# Altium project STM32P20.PrjPCB
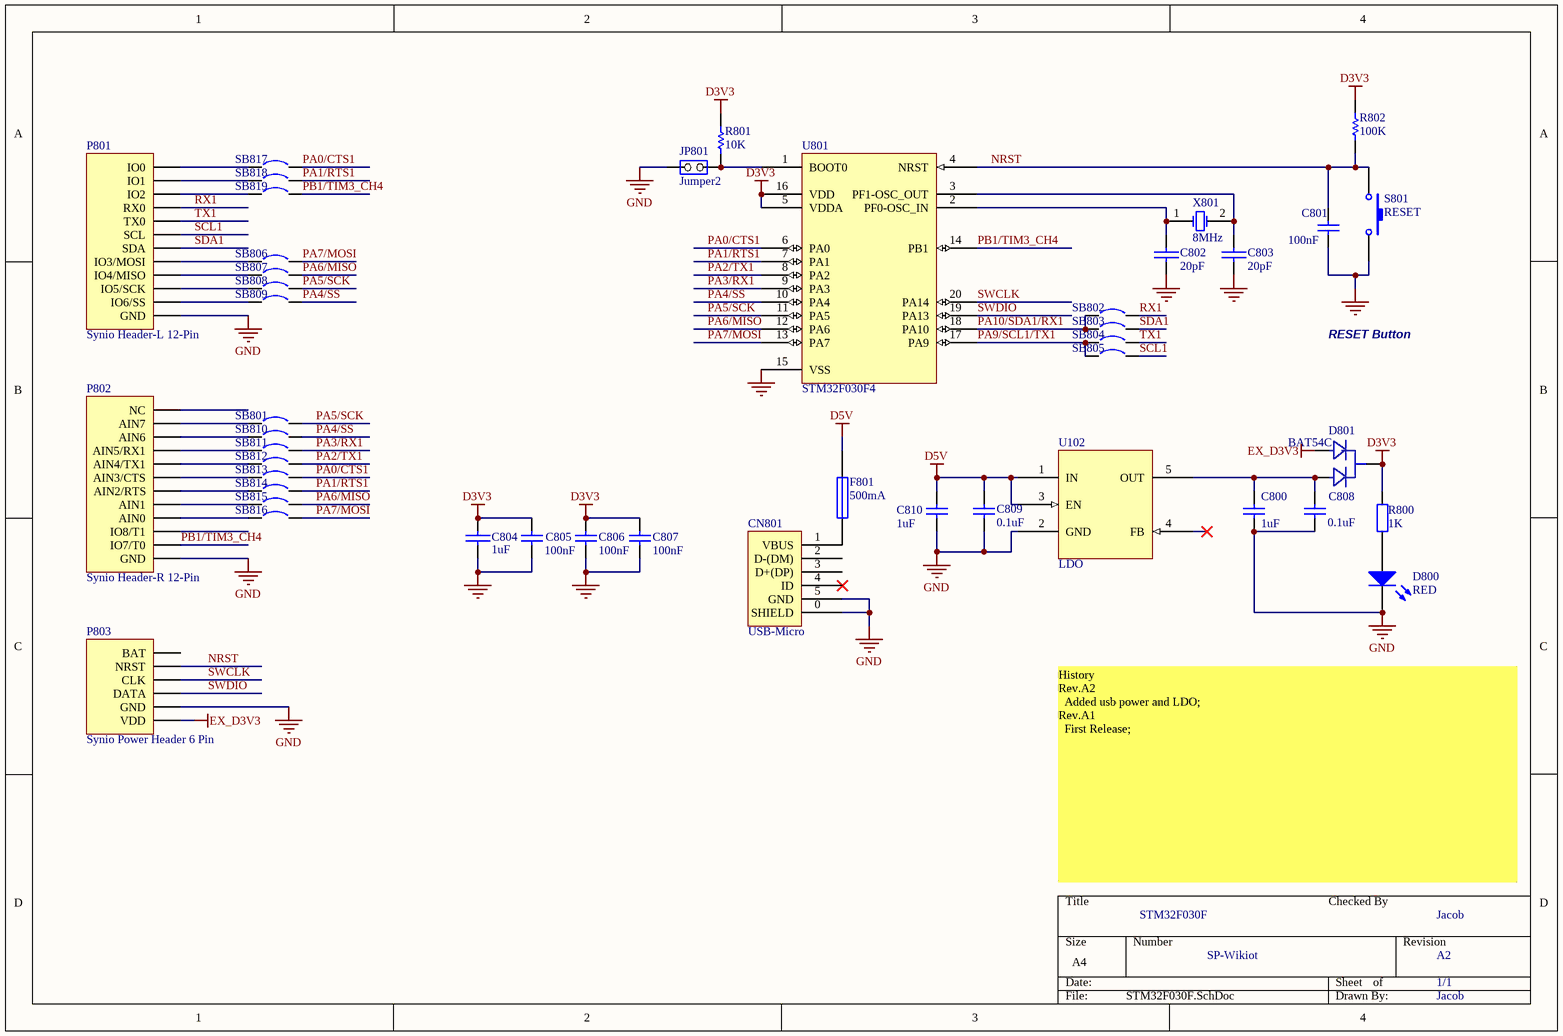
[diagram p0: STM32F030F.SchDoc]
1 sheet, 45 parts. Net scope: global (net labels, ports and power ports of the same name join across sheets).
Board file: STM32F030F.PcbDoc

## Sheet STM32F030F.SchDoc
size A4

### Parts
C800  1uF  [0603M]
C801  100nF  [0603M]
C802  20pF  [0603M]
C803  20pF  [0603M]
C804  1uF  [0603M]
C805  100nF  [0603M]
C806  100nF  [0603M]
C807  100nF  [0603M]
C808  0.1uF  [0603M]
C809  0.1uF  [0603M]
C810  1uF  [0603M]
CN801  USB-Micro  [USB-MICRO-Female-Lite]
D800  RED  [0603pn]
D801  BAT54C  [BAT54C]
F801  500mA  [0805]
JP801  Jumper2  [SIP2]
P801  Synio Header-L 12-Pin  [HDR1X12]
P802  Synio Header-R 12-Pin  [HDR1X12]
P803  Synio Power Header 6 Pin  [HDR1X6/2.54MM]
R800  1K  [0603M]
R801  10K  [0603M]
R802  100K  [0603M]
S801  RESET  [KEY-2x4-SMD]
SB801  Circuit Breaker  [JP2_SMD]  (value not drawn)
SB802  Circuit Breaker  [JP2_SMD]  (value not drawn)
SB803  Circuit Breaker  [JP2_SMD]  (value not drawn)
SB804  Circuit Breaker  [JP2_SMD]  (value not drawn)
SB805  Circuit Breaker  [JP2_SMD]  (value not drawn)
SB806  Circuit Breaker  [JP2_SMD]  (value not drawn)
SB807  Circuit Breaker  [JP2_SMD]  (value not drawn)
SB808  Circuit Breaker  [JP2_SMD]  (value not drawn)
SB809  Circuit Breaker  [JP2_SMD]  (value not drawn)
SB810  Circuit Breaker  [JP2_SMD]  (value not drawn)
SB811  Circuit Breaker  [JP2_SMD]  (value not drawn)
SB812  Circuit Breaker  [JP2_SMD]  (value not drawn)
SB813  Circuit Breaker  [JP2_SMD]  (value not drawn)
SB814  Circuit Breaker  [JP2_SMD]  (value not drawn)
SB815  Circuit Breaker  [JP2_SMD]  (value not drawn)
SB816  Circuit Breaker  [JP2_SMD]  (value not drawn)
SB817  Circuit Breaker  [JP2_SMD]  (value not drawn)
SB818  Circuit Breaker  [JP2_SMD]  (value not drawn)
SB819  Circuit Breaker  [JP2_SMD]  (value not drawn)
U102  LDO  [SOT23-5]
U801  STM32F030F4  [TSSOP20]
X801  8MHz  [XTAL_49S]

### Nets
D3V3: C804.1 C805.1 C806.1 C807.1 D801.3 R800.2 R801.1 R802.2 U801.5(VDDA) U801.16(VDD)
D5V: C809.2 C810.2 F801.1 U102.1(IN) U102.3(EN)
EX_D3V3: D801.1 P803.1(VDD)
GND: C800.1 C801.1 C802.2 C803.2 C804.2 C805.2 C806.2 C807.2 C808.1 C809.1 C810.1 CN801.0(SHIELD) CN801.5(GND) D800.2(K) JP801.1(COMMON) P801.1(GND) P802.1(GND) P803.2(GND) S801.1 U102.2(GND) U801.15(VSS)
NRST: C801.2 P803.5(NRST) R802.1 S801.2 U801.4(NRST)
PA0/CTS1: SB813.2 SB817.2 U801.6(PA0)
PA1/RTS1: SB814.2 SB818.2 U801.7(PA1)
PA2/TX1: SB812.2 U801.8(PA2)
PA3/RX1: SB811.2 U801.9(PA3)
PA4/SS: SB809.2 SB810.2 U801.10(PA4)
PA5/SCK: SB801.2 SB808.2 U801.11(PA5)
PA6/MISO: SB807.2 SB815.2 U801.12(PA6)
PA7/MOSI: SB806.2 SB816.2 U801.13(PA7)
PA9/SCL1/TX1: SB804.1 SB805.1 U801.17(PA9)
PA10/SDA1/RX1: SB802.1 SB803.1 U801.18(PA10)
PB1/TIM3_CH4: P802.2(IO7/T0) SB819.2 U801.14(PB1)
RX1: P801.9(RX0) SB802.2
SCL1: P801.7(SCL) SB805.2
SDA1: P801.6(SDA) SB803.2
SWCLK: P803.4(CLK) U801.20(PA14)
SWDIO: P803.3(DATA) U801.19(PA13)
TX1: P801.8(TX0) SB804.2
NetC800_2: C800.2 C808.2 D801.2 U102.5(OUT)
NetC802_1: C802.1 U801.2(PF0-OSC_IN) X801.1(OSC1)
NetC803_1: C803.1 U801.3(PF1-OSC_OUT) X801.2(OSC2)
NetCN801_1: CN801.1(VBUS) F801.2
NetD800_1: D800.1(A) R800.1
NetJP801_2: JP801.2(NO) R801.2 U801.1(BOOT0)
NetP801_2: P801.2(IO6/SS) SB809.1
NetP801_3: P801.3(IO5/SCK) SB808.1
NetP801_4: P801.4(IO4/MISO) SB807.1
NetP801_5: P801.5(IO3/MOSI) SB806.1
NetP801_10: P801.10(IO2) SB819.1
NetP801_11: P801.11(IO1) SB818.1
NetP801_12: P801.12(IO0) SB817.1
NetP802_4: P802.4(AIN0) SB816.1
NetP802_5: P802.5(AIN1) SB815.1
NetP802_6: P802.6(AIN2/RTS) SB814.1
NetP802_7: P802.7(AIN3/CTS) SB813.1
NetP802_8: P802.8(AIN4/TX1) SB812.1
NetP802_9: P802.9(AIN5/RX1) SB811.1
NetP802_10: P802.10(AIN6) SB810.1
NetP802_11: P802.11(AIN7) SB801.1

Not connected (* = marked no-connect by the designer): CN801 2(D-(DM)) 3(D+(DP)) 4(ID)*; P802 3(IO8/T1) 12(NC); P803 6(BAT); U102 4(FB)*

### Notes on the sheet
- RESET Button
- History
  Rev.A2
  Added usb power and LDO;
  Rev.A1
  First Release;
- STM32F030F
- Checked By
- Jacob
- SP-Wikiot
- A2
- 1/1

### Library data of the parts
C800 C808-C810 = Cap: Capacitor; Published: 8-Jun-2000; LatestRevisionDate: 17-Jul-2002; LatestRevisionNote: Re-released for DXP Platform.; PackageReference: RAD-0.3
  C800 C810: Value: 1uF
  C808 C809: Value: 0.1uF
C801 C804 = CAP: Capacitor
  C801: Published: 8-Jun-2000; Revision: July-2002: Re-released for DXP Platform.; Publisher: Altium Limited; Value: 100nF
C802 C803 = CAP: Capacitor; Fitted: NO
C805-C807 = Cap: Capacitor; Value: 10nF; Published: 8-Jun-2000; Revision: July-2002: Re-released for DXP Platform.; Publisher: Altium Limited
D800 = LED0: Typical INFRARED GaAs LED; Published: 8-Jun-2000; LatestRevisionDate: 08-Jul-2005; LatestRevisionNote: Mech Layer 1 removed.; PackageReference: LED-0; Publisher: Altium Limited
D801 = BAT54C: DOUBLE SHOTTKEY DIODES
F801 = Fuse 1: Fuse; Published: 8-Jun-2000; LatestRevisionDate: 17-Jul-2002; LatestRevisionNote: Re-released for DXP Platform.; PackageReference: PIN-W2/E2.8; Publisher: Altium Limited; PackageDescription: Thru-Hole; 2 Leads
JP801 = Jumper2-2
P801 = Synio Header-L 12-Pin: Synio Header-L, 12-Pin; LatestRevisionDate: 17-Jul-2002; LatestRevisionNote: Re-released for DXP Platform.; Publisher: Altium Limited
P802 = Synio Header-R 12-Pin: Synio Header-R, 12-Pin; LatestRevisionDate: 17-Jul-2002; LatestRevisionNote: Re-released for DXP Platform.; Publisher: Altium Limited
R800 = Res2: Resistor; Published: 8-Jun-2000; LatestRevisionDate: 17-Jul-2002; LatestRevisionNote: Re-released for DXP Platform.; PackageReference: AXIAL-0.4; Publisher: Altium Limited; Value: 1K
R801 R802 = res1: Resistor; Fitted: NO; Published: 8-Jun-2000; Revision: July-2002: Re-released for DXP Platform.; Publisher: Altium Limited
  R801: Value: 10K
  R802: Value: 100K
S801 = SW-PB: Switch; Published: 24-Mar-1999; LatestRevisionDate: 17-Jul-2002; LatestRevisionNote: Re-released for DXP Platform.; PackageReference: SPST-2; Publisher: Altium Limited
SB801-SB819 = Circuit Breaker: Solder: YES; Published: 24-Mar-1999; Revision: July-2002: Re-released for DXP Platform.; Publisher: Altium Limited
U102 = LDO-SOT23-5: General LDO SOT23-5
X801 = XTAL: Crystal Oscillator; Fitted: NO; Published: 8-Jun-2000; LatestRevisionDate: 17-Jul-2002; LatestRevisionNote: Re-released for DXP Platform.; PackageReference: R38; Publisher: Altium Limited